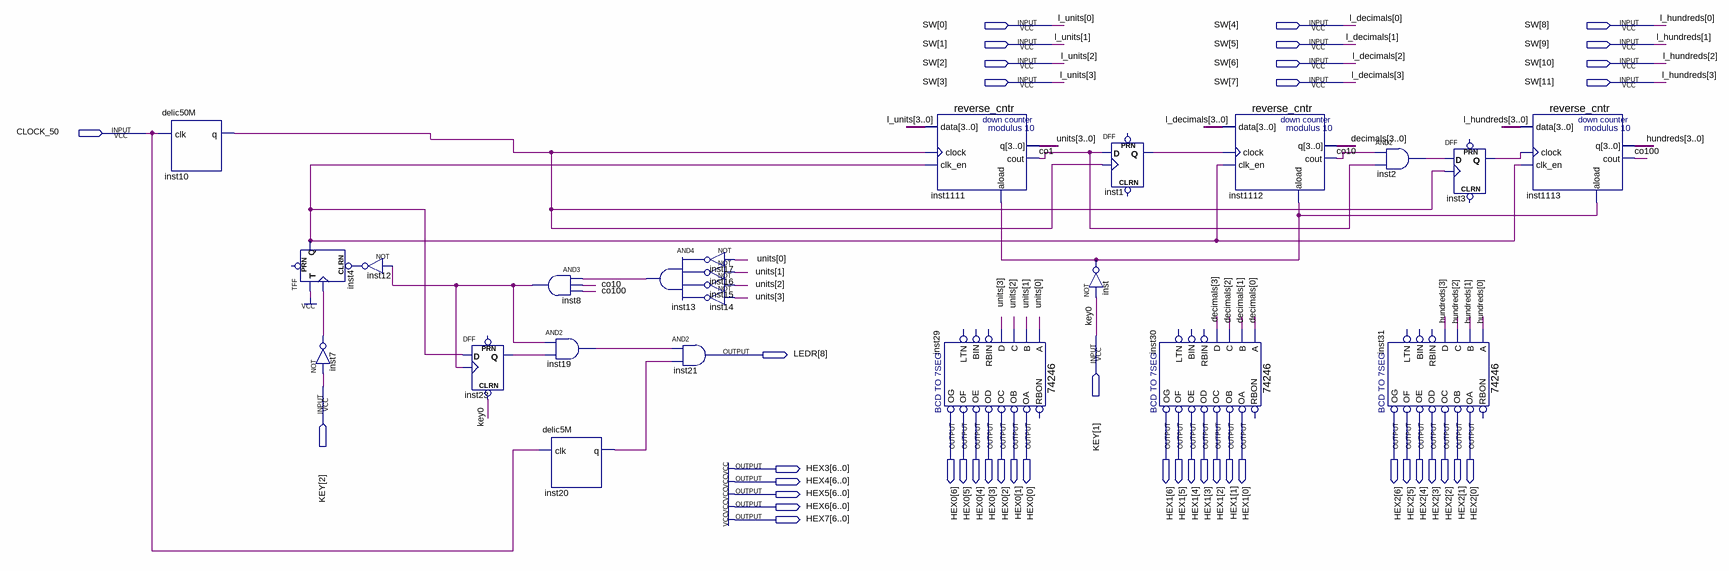
[diagram p0: schematic sheet]
// Quartus schematic hodiny.bdf as structural Verilog: 24 symbols, 42 pins
module hodiny (
  input  [11:0] SW,
  input  CLOCK_50,
  input  [2:1] KEY,
  output [8:8] LEDR,
  output [6:0] HEX0,
  output [6:0] HEX1,
  output [6:0] HEX2,
  output [6:0] HEX3,
  output [6:0] HEX4,
  output [6:0] HEX5,
  output [6:0] HEX6,
  output [6:0] HEX7
);

  wire co1, co10, co100, inst1_q, inst2_out, inst3_q, inst4_q, inst7_out, inst8_out, inst10_q, inst12_out,
       inst13_out, inst14_out, inst15_out, inst16_out, inst17_out, inst19_out, inst20_q, inst23_q, inst_out;
  wire [3:0] decimals, hundreds, units;

  delic50M inst10 (.clk(CLOCK_50), .q(inst10_q));
  TFF inst4 (.CLRN(inst12_out), .T(1'b1), .CLK(inst7_out), .Q(inst4_q));  // open: PRN
  not inst7 (inst7_out, KEY[2]);
  not inst12 (inst12_out, inst8_out);
  DFF inst23 (.CLRN(KEY[1]), .CLK(inst8_out), .D(inst4_q), .Q(inst23_q));  // open: PRN
  and inst8 (inst8_out, inst13_out, co10, co100);
  and inst19 (inst19_out, inst8_out, inst23_q);
  delic5M inst20 (.clk(CLOCK_50), .q(inst20_q));
  and inst13 (inst13_out, inst17_out, inst16_out, inst15_out, inst14_out);
  not inst17 (inst17_out, units[0]);
  not inst16 (inst16_out, units[1]);
  not inst15 (inst15_out, units[2]);
  not inst14 (inst14_out, units[3]);
  and inst21 (LEDR[8], inst19_out, inst20_q);
  reverse_cntr inst1111 (.data(SW[3:0]), .clock(inst10_q), .clk_en(inst4_q), .aload(inst_out), .q(units), .cout(co1));
  \74246  inst29 (
    .B(units[1]), .A(units[0]), .D(units[3]), .C(units[2]), .OD(HEX0[3]), .OC(HEX0[2]), .OB(HEX0[1]),
    .OE(HEX0[4]), .OF(HEX0[5]), .OA(HEX0[0]), .OG(HEX0[6]));  // open: RBIN, LTN, BIN, RBON
  DFF inst1 (.CLK(inst10_q), .D(co1), .Q(inst1_q));  // open: CLRN, PRN
  not inst (inst_out, KEY[1]);
  \74246  inst30 (
    .B(decimals[1]), .A(decimals[0]), .D(decimals[3]), .C(decimals[2]), .OD(HEX1[3]), .OC(HEX1[2]),
    .OB(HEX1[1]), .OE(HEX1[4]), .OF(HEX1[5]), .OA(HEX1[0]), .OG(HEX1[6]));  // open: RBIN, LTN, BIN, RBON
  reverse_cntr inst1112 (
    .data(SW[7:4]), .clock(inst1_q), .clk_en(inst4_q), .aload(inst_out), .q(decimals), .cout(co10));
  and inst2 (inst2_out, co10, co1);
  \74246  inst31 (
    .B(hundreds[1]), .A(hundreds[0]), .D(hundreds[3]), .C(hundreds[2]), .OD(HEX2[3]), .OC(HEX2[2]),
    .OB(HEX2[1]), .OE(HEX2[4]), .OF(HEX2[5]), .OA(HEX2[0]), .OG(HEX2[6]));  // open: RBIN, LTN, BIN, RBON
  DFF inst3 (.CLK(inst10_q), .D(inst2_out), .Q(inst3_q));  // open: CLRN, PRN
  reverse_cntr inst1113 (
    .data(SW[11:8]), .clock(inst3_q), .clk_en(inst4_q), .aload(inst_out), .q(hundreds), .cout(co100));

  assign HEX3 = {7{1'b1}};
  assign HEX4 = {7{1'b1}};
  assign HEX5 = {7{1'b1}};
  assign HEX6 = {7{1'b1}};
  assign HEX7 = {7{1'b1}};

  // Other names for the same wires on the sheet: key0 = KEY[1]; l_decimals[3:0] = SW[7:4]; l_hundreds[3:0] = SW[11:8];
  //   l_units[3:0] = SW[3:0]
endmodule
